# Altium project PCB_Project1.PrjPCB
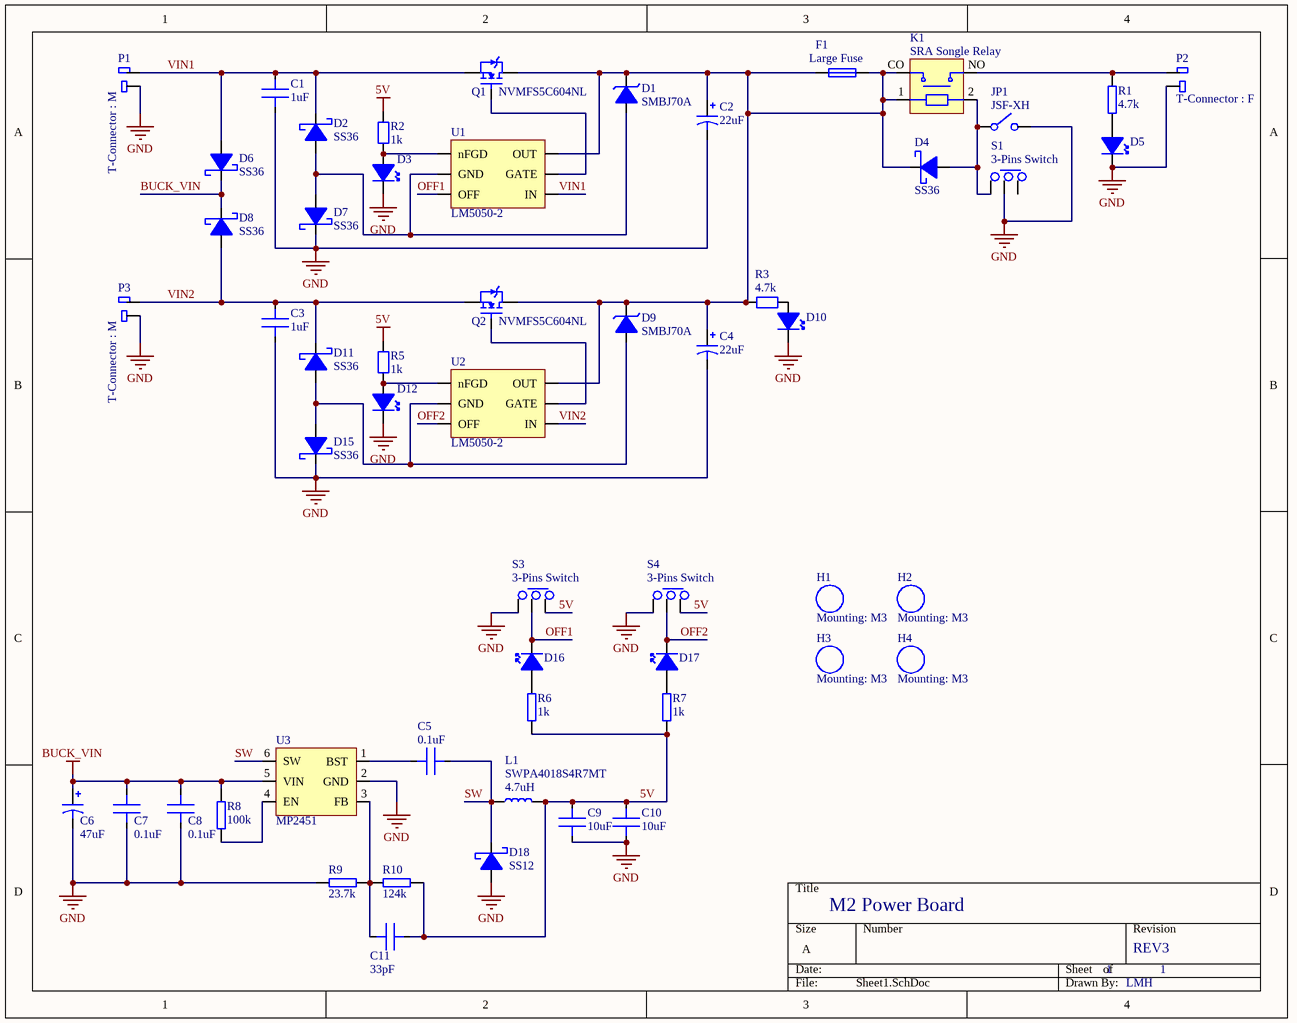
[diagram p0: Sheet1.SchDoc]
1 sheet, 55 parts. Net scope: global (net labels, ports and power ports of the same name join across sheets).
Board file: PCB1.PcbDoc

## Sheet Sheet1.SchDoc
size A

### Parts
C1  value 1uF  [CAP 0805/2012]  (hidden comment: Cap : Unpolarized)
C2  value 22uF  [CAP AL C 5.3MM]  (hidden comment: Cap : Polarized)
C3  value 1uF  [CAP 0805/2012]  (hidden comment: Cap : Unpolarized)
C4  value 22uF  [CAP AL C 5.3MM]  (hidden comment: Cap : Polarized)
C5  value 0.1uF  [CAP 0805/2012]  (hidden comment: Cap : Unpolarized)
C6  value 47uF  [CAP AL D 6.6MM]  (hidden comment: Cap : Polarized)
C7  value 0.1uF  [CAP 0805/2012]  (hidden comment: Cap : Unpolarized)
C8  value 0.1uF  [CAP 0805/2012]  (hidden comment: Cap : Unpolarized)
C9  value 10uF  [CAP 1206/3216]  (hidden comment: Cap : Unpolarized)
C10  value 10uF  [CAP 1206/3216]  (hidden comment: Cap : Unpolarized)
C11  value 33pF  [CAP 0805/2012]  (hidden comment: Cap : Unpolarized)
D1  SMBJ70A  [SMB (DO-214AA)]
D2  SS36  [SMA (DO-214AC)]
D3  LED  [LED 0805/2012]  (value not drawn)
D4  SS36  [SMA (DO-214AC)]
D5  LED  [LED 0805/2012]  (value not drawn)
D6  SS36  [SMA (DO-214AC)]
D7  SS36  [SMA (DO-214AC)]
D8  SS36  [SMA (DO-214AC)]
D9  SMBJ70A  [SMB (DO-214AA)]
D10  LED  [LED 0805/2012]  (value not drawn)
D11  SS36  [SMA (DO-214AC)]
D12  LED  [LED 0805/2012]  (value not drawn)
D15  SS36  [SMA (DO-214AC)]
D16  LED  [LED 0805/2012]  (value not drawn)
D17  LED  [LED 0805/2012]  (value not drawn)
D18  SS12  [SMA (DO-214AC)]
F1  Large Fuse  [Fuse]
H1  Mounting: M3  [Mounting hole M3]
H2  Mounting: M3  [Mounting hole M3]
H3  Mounting: M3  [Mounting hole M3]
H4  Mounting: M3  [Mounting hole M3]
JP1  Name: JSF-XH  [2-Pins Header]  (hidden comment: 2-Pins Header)
K1  SRA Songle Relay  [SRA Songle Relay]
L1  SWPA4018S4R7MT  value 4.7uH  [SWPA4018S4R7MT]
P1  T-Connector : M  [T CONNECTOR M]
P2  T-Connector : F  [T CONNECTOR F]
P3  T-Connector : M  [T CONNECTOR M]
Q1  NVMFS5C604NL  [NVMFS5C604NL]
Q2  NVMFS5C604NL  [NVMFS5C604NL]
R1  value 4.7k  [RES 0805/2012]  (hidden comment: Res)
R2  value 1k  [RES 0805/2012]  (hidden comment: Res)
R3  value 4.7k  [RES 0805/2012]  (hidden comment: Res)
R5  value 1k  [RES 0805/2012]  (hidden comment: Res)
R6  value 1k  [RES 0805/2012]  (hidden comment: Res)
R7  value 1k  [RES 0805/2012]  (hidden comment: Res)
R8  value 100k  [RES 0805/2012]  (hidden comment: Res)
R9  value 23.7k  [RES 0805/2012]  (hidden comment: Res)
R10  value 124k  [RES 0805/2012]  (hidden comment: Res)
S1  3-Pins Switch  [3-Pins Switch]
S3  3-Pins Switch  [3-Pins Switch]
S4  3-Pins Switch  [3-Pins Switch]
U1  LM5050-2  [SOT23-6]
U2  LM5050-2  [SOT23-6]
U3  MP2451  [SOT23-6]

### Nets
5V: C9.2 C10.2 C11.2 L1.2 R2.2 R5.2 R6.1 R7.1 R10.2 S3.3 S4.3
BUCK_VIN: C6.A C7.2 C8.2 D6.K D8.K R8.2 U3.5(VIN)
GND: C1.1 C2.K C3.1 C4.K C6.K C7.1 C8.1 C9.1 C10.1 D3.K D5.K D7.K D10.K D12.K D15.K D18.A JP1.2 P1.N P2.N(-) P3.N R9.1 S1.2 S3.1 S4.1 U3.2(GND)
OFF1: D16.K S3.2 U1.3(OFF)
OFF2: D17.K S4.2 U2.3(OFF)
SW: C5.2 D18.K L1.1 U3.6(SW)
VIN1: C1.2 D2.K D6.A P1.P Q1.S U1.4(IN)
VIN2: C3.2 D8.A D11.K P3.P Q2.S U2.4(IN)
NetC2_A: C2.A C4.A D1.K D4.K D9.K F1.1 F1.2 K1.1(Coil1) K1.CO(Relay1) Q1.D Q2.D R3.2 U1.6(OUT) U2.6(OUT)
NetC5_1: C5.1 U3.1(BST)
NetC11_1: C11.1 R9.2 R10.1 U3.3(FB)
NetD1_A: D1.A D2.A D7.A U1.2(GND)
NetD3_A: D3.A R2.1 U1.1(nFGD)
NetD4_A: D4.A JP1.1 K1.2(Coil2) S1.1
NetD5_A: D5.A R1.1
NetD9_A: D9.A D11.A D15.A U2.2(GND)
NetD10_A: D10.A R3.1
NetD12_A: D12.A R5.1 U2.1(nFGD)
NetD16_A: D16.A R6.2
NetD17_A: D17.A R7.2
NetK1_NO: K1.NO(Relay2) P2.P(+) R1.2
NetQ1_G: Q1.G U1.5(GATE)
NetQ2_G: Q2.G U2.5(GATE)
NetR8_1: R8.1 U3.4(EN)

Not connected (* = marked no-connect by the designer): S1 3

### Notes on the sheet
- M2 Power Board
- 1
- REV3
- LMH

### Library data of the parts
C1 C3 C5 C7-C11 = Cap : Unpolarized: Unpolarized Capacitor
C2 C4 C6 = Cap : Polarized: Polarized Capacitor
D1 D9 = SMBJ70A: Transient Voltage Suppression Diodes; ComponentLink1Description: SMBJ70A; ComponentLink1URL: http://www.littelfuse.com/~/media/electronics/datasheets/tvs_diodes/littelfuse_tvs_diode_smbj_datasheet.pdf.pdf; ComponentLink2Description: SMBJ70A_TaoBao; ComponentLink2URL: https://item.taobao.com/item.htm?spm=a230r.1.14.18.167673edhP2qwe&id=564794336232&ns=1&abbucket=13#detail; Name: SMBJ70A
D2 D4 D6-D8 D11 D15 = SS36: Surface Mount Schottky Barrier Rectifier; ComponentLink1Description: SS36; ComponentLink1URL: https://www.vishay.com/docs/88751/ss32.pdf; ComponentLink2Description: SS36_TaoBao; ComponentLink2URL: https://item.taobao.com/item.htm?spm=a1z0d.7625083.1998302264.6.686c4e69YVpoGp&id=545485003984; Name: SS36
D18 = SS12: Surface Mount Schottky Barrier Rectifier; ComponentLink1Description: SS12; ComponentLink1URL: https://www.vishay.com/docs/88746/ss12.pdf; ComponentLink2Description: SS12_TaoBao; ComponentLink2URL: https://item.taobao.com/item.htm?spm=a1z10.3-c-s.w4002-16569462289.23.52e96a4bPeluV8&id=545464510804; Name: SS12
F1 = Large Fuse: Large size fuse
H1-H4 = Mounting: M3: Mounting Hole: M3
K1 = SRA Songle Relay: 20A Relay; ComponentLink1Description: SRA Songle Relay; ComponentLink1URL: https://www.rlocman.ru/i/File/2018/02/21/SRA--T74-.pdf
L1 = SWPA4018S4R7MT: Wire Wound SMD Power Inductor ; 4.7uH ; 1.7A; ComponentLink1Description: SWPA4018S4R7MT; ComponentLink1URL: https://www.datasheets360.com/pdf/-5671755628400742870
P1 P3 = T-Connector : M: T-shape connector ; Male side; Name: T-Connector : M
P2 = T-Connector : F: T-shape connector ; Female side; Name: T-Connector : F
Q1 Q2 = NVMFS5C604NL: Power MOSFET ; 60 V ; 1.2 mR ; 287A ; Single N−Channel; ComponentLink1Description: NVMFS5C604NL; ComponentLink1URL: http://www.onsemi.cn/PowerSolutions/document/NVMFS5C604NL-D.PDF; Name: NVMFS5C604NL
R1-R3 R5-R10 = Res: Resistor
S1 S3 S4 = 3-Pins Switch: SS12d00G3; ComponentLink1Description: SS12d00G3; ComponentLink1URL: https://item.taobao.com/item.htm?spm=a1z09.2.0.0.42022e8dz0ovVy&id=522571770484&_u=133pjrv7231a; Name: 3-Pins Switch
U1 U2 = LM5050-2: High-Side OR-ing FET Controller; ComponentLink1Description: LM5050-2; ComponentLink1URL: http://www.ti.com/lit/ds/symlink/lm5050-2.pdf; Name: LM5050-2
U3 = MP2451: Step-Down Converter ; 36V ; 2MHz ; 0.6A; ComponentLink1Description: MP2451; ComponentLink1URL: https://www.mouser.com/ds/2/277/MP2451_r1.33-477967.pdf; Name: MP2451
D3 D5 D10 D12 D16 D17 = LED: Name: *